# EAGLE schematic 20170814_DukeExperimentalHeadstageAmplifier (EAGLE 8.2.2)
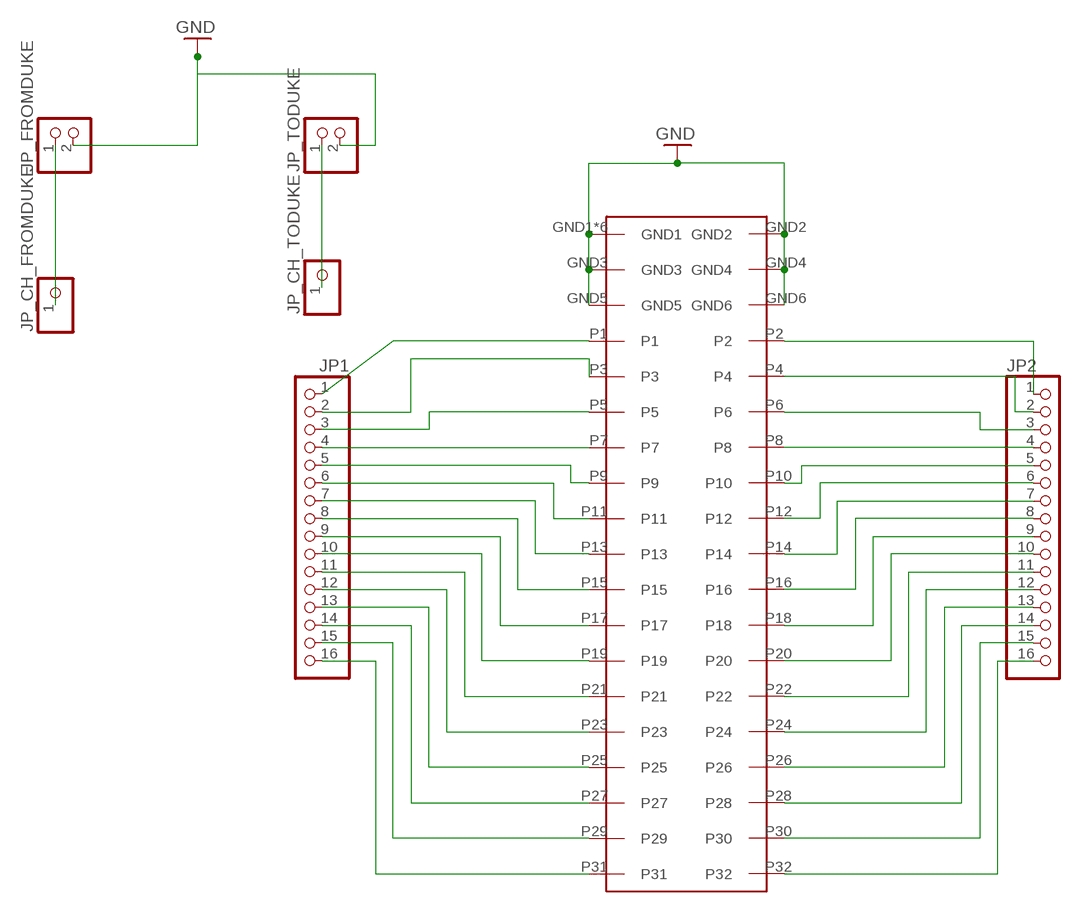
[diagram p0: schematic, sheet 1]

## Parts
JP1  PINHD-1X16  [1X16]
JP2  PINHD-1X16  [1X16]
JP_CH_FROMDUKE  PINHD-1X1  [1X01]
JP_CH_TODUKE  PINHD-1X1  [1X01]
JP_FROMDUKE  PINHD-1X2  [1X02]
JP_TODUKE  PINHD-1X2  [1X02]
U$1  MIS-019-01-H-D  [MIS-019-01-H-D]

## Nets
GND: JP_FROMDUKE.2 JP_TODUKE.2 U$1.GND1 U$1.GND2 U$1.GND3 U$1.GND4 U$1.GND5 U$1.GND6 U$1.SH1(GND1) U$1.SH2(GND1) U$1.SH3(GND1) U$1.SH4(GND1) U$1.SH5(GND1)
N$1: JP1.1 U$1.P1
N$2: JP1.2 U$1.P3
N$3: JP1.3 U$1.P5
N$4: JP1.4 U$1.P7
N$5: JP1.5 U$1.P9
N$6: JP1.6 U$1.P11
N$7: JP1.7 U$1.P13
N$8: JP1.8 U$1.P15
N$9: JP1.9 U$1.P17
N$10: JP1.10 U$1.P19
N$11: JP1.11 U$1.P21
N$12: JP1.12 U$1.P23
N$13: JP1.13 U$1.P25
N$14: JP1.14 U$1.P27
N$15: JP1.15 U$1.P29
N$16: JP1.16 U$1.P31
N$17: JP2.1 U$1.P2
N$18: JP2.2 U$1.P4
N$19: JP2.3 U$1.P6
N$20: JP2.4 U$1.P8
N$21: JP2.5 U$1.P10
N$22: JP2.6 U$1.P12
N$23: JP2.7 U$1.P14
N$24: JP2.8 U$1.P16
N$25: JP2.9 U$1.P18
N$26: JP2.10 U$1.P20
N$27: JP2.11 U$1.P22
N$28: JP2.12 U$1.P24
N$29: JP2.13 U$1.P26
N$30: JP2.14 U$1.P28
N$31: JP2.15 U$1.P30
N$32: JP2.16 U$1.P32
N$34: JP_CH_TODUKE.1 JP_TODUKE.1
N$35: JP_CH_FROMDUKE.1 JP_FROMDUKE.1

## Library data of the parts
JP1 JP2 = pinhead:PINHD-1X16: PIN HEADER
JP_CH_FROMDUKE JP_CH_TODUKE = pinhead:PINHD-1X1: PIN HEADER
JP_FROMDUKE JP_TODUKE = pinhead:PINHD-1X2: PIN HEADER
U$1 = Sombeck_lib:MIS-019-01-H-D